# Altium project bdcmc-26.PrjPcb (part 2 of 2)
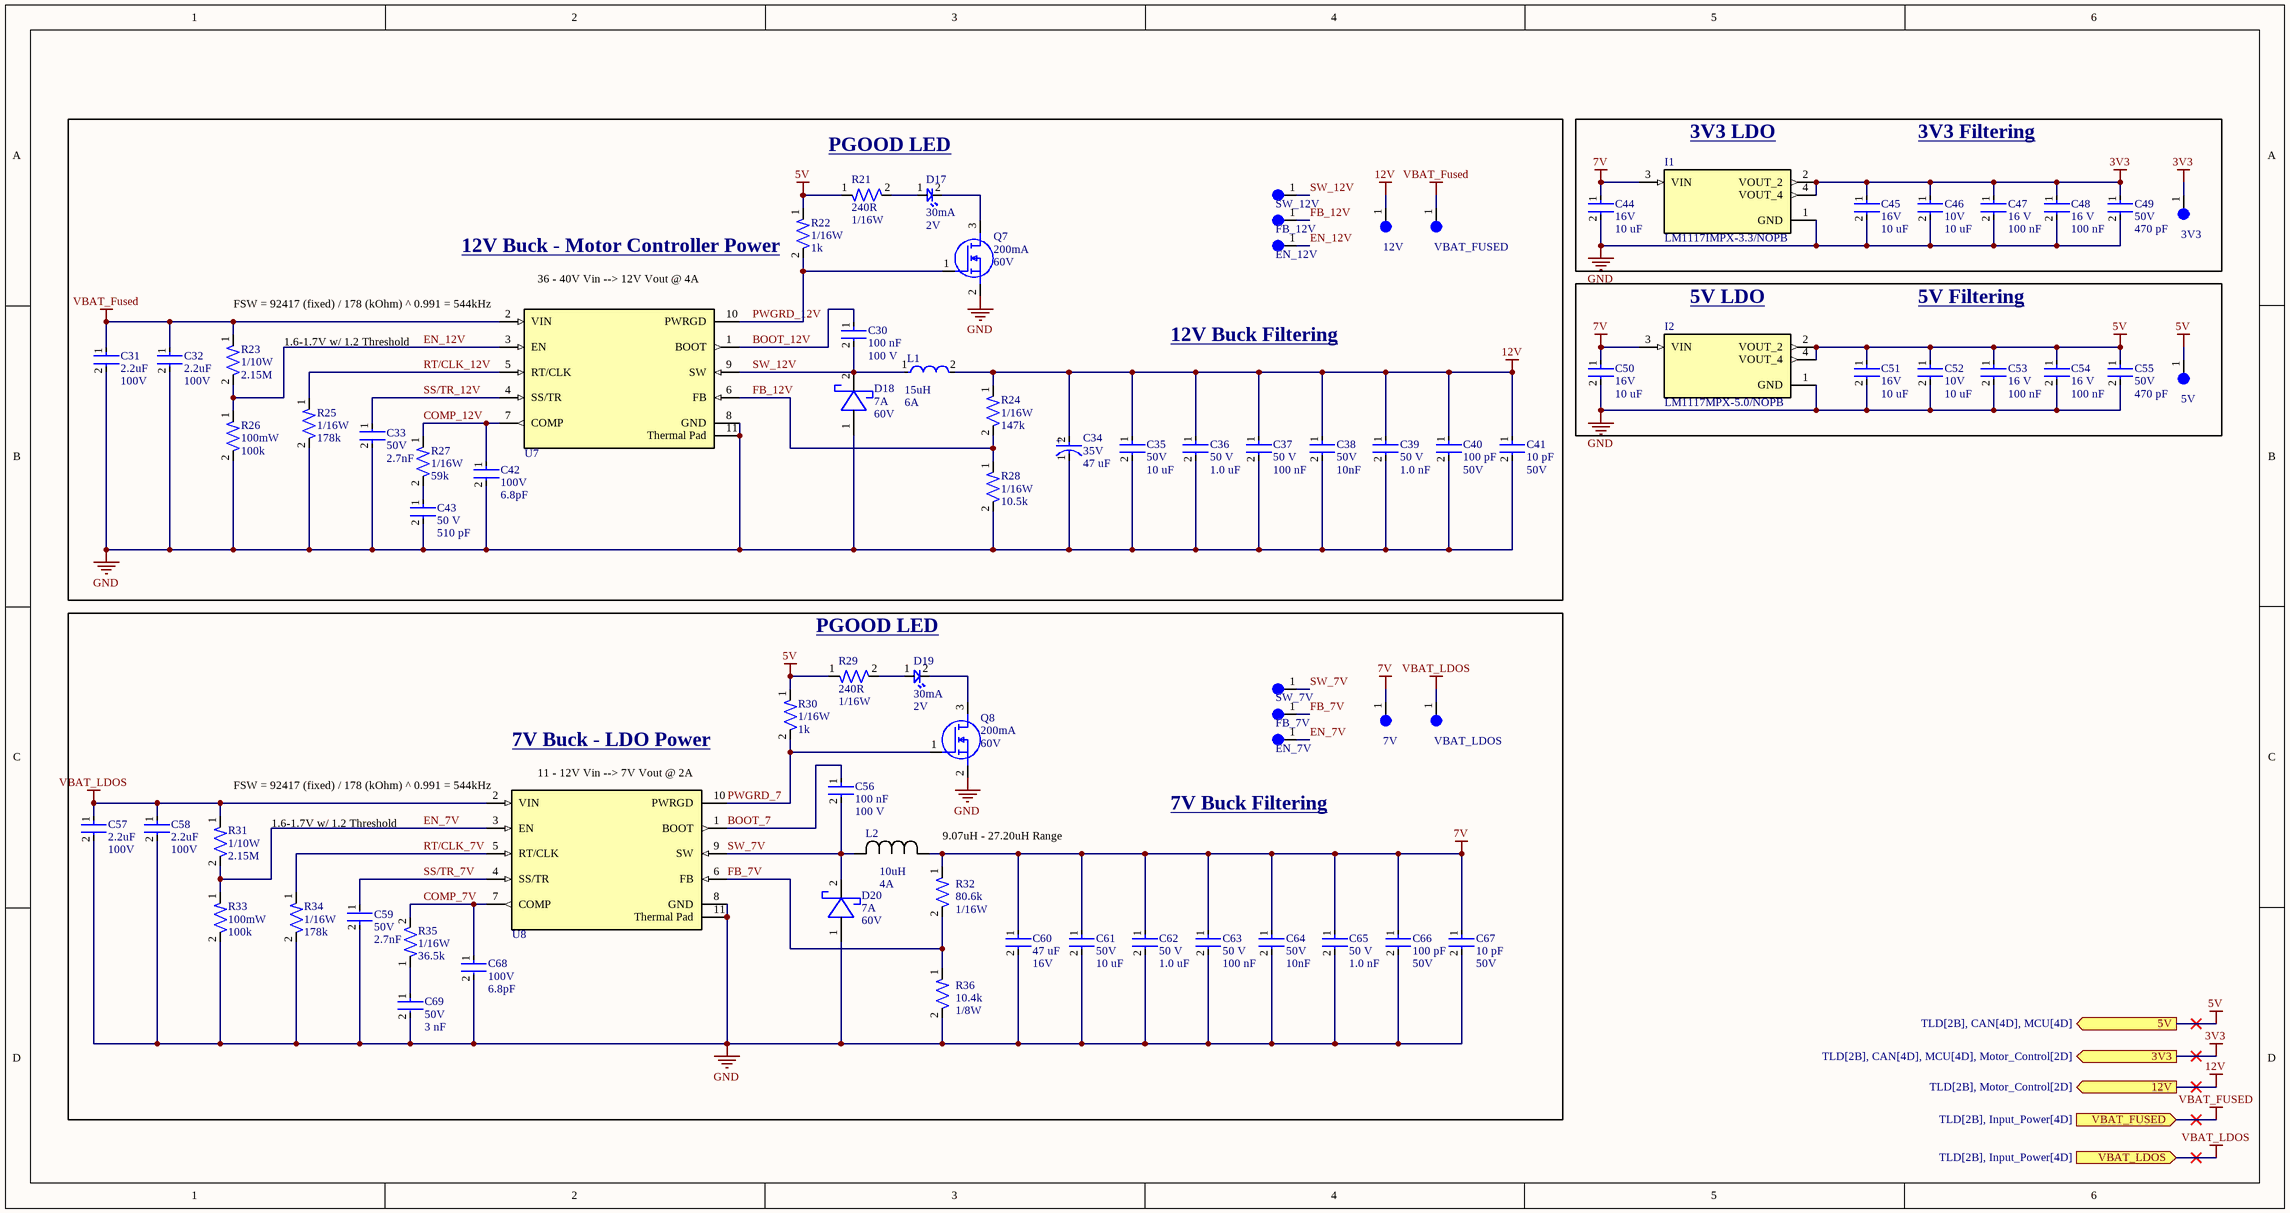
[diagram p6: Power_Regulation.SchDoc]

## Nets that join several sheets
3V3: CAN (R6.2 R8.2 U3.5), MCU (21 pins), Motor_Control (10 pins), Power_Regulation (8 pins)
5V: CAN (U3.3), MCU (X1.P$1), Power_Regulation (12 pins)
12V: Motor_Control (R1.2 R10.2 R39.1), Power_Regulation (11 pins)
24V: Input_Power (24V_FUSE.2), Motor_Control (R41.1)
GND: CAN (5 pins), Input_Power (23 pins), MCU (26 pins), Motor_Control (35 pins), Power_Regulation (54 pins)
VBAT_FUSED: Input_Power (12V_FUSE.2), Power_Regulation (5 pins)
VBAT_LDOS: Input_Power (7V_FUSE.2), Power_Regulation (5 pins)
CAN_RX_LED: CAN (R9.2), MCU (U2.25)
CAN_STB: CAN (U3.8), MCU (U2.42)
CAN_TX_LED: CAN (R7.2), MCU (U2.26)
CSNS: MCU (U2.8), Motor_Control (C78.2 R42.2)
FDCAN_RX: CAN (U3.4), MCU (U2.33)
FDCAN_TX: CAN (U3.1), MCU (U2.34)
MOTOR_DIR: MCU (U2.27), Motor_Control (U5.6 U6.6)
MOTOR_PWM: MCU (U2.30), Motor_Control (U5.2 U6.1)